# EAGLE design Filter Board rev1 (EAGLE 9.6.2)

## Sheet 1 of 4
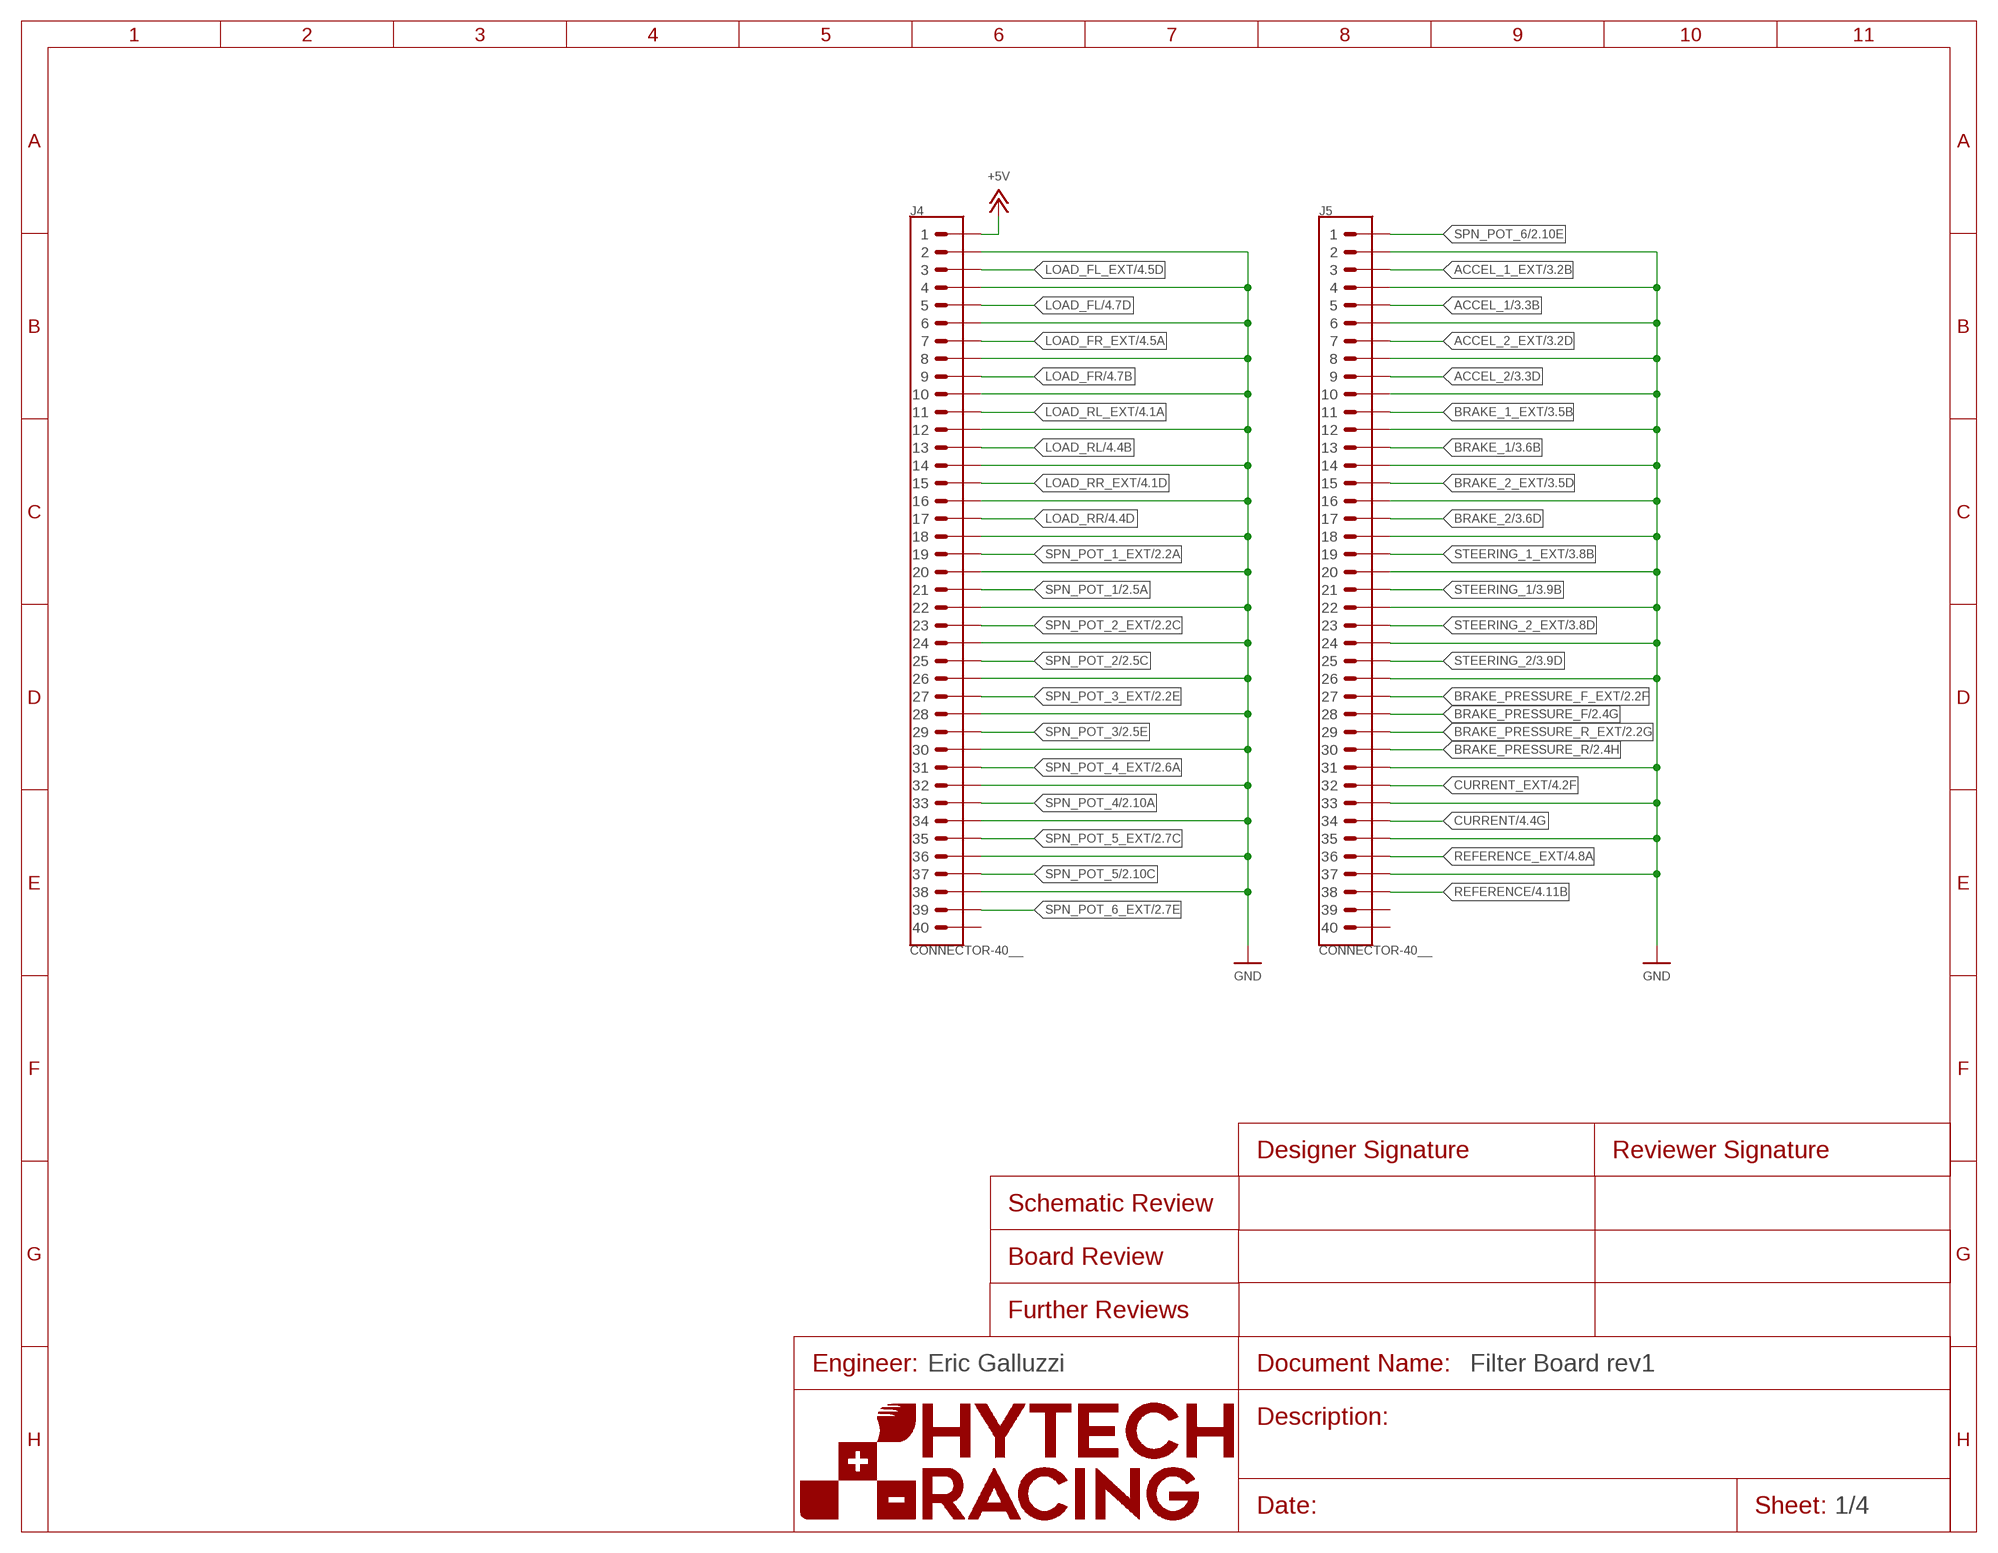
[diagram p0: schematic, sheet 1]
FRAME1 (FRAME): ENGINEER: Eric Galluzzi

### Parts
J4  CONNECTOR-40__  [EHT-120-01]
J5  CONNECTOR-40__  [EHT-120-01]

### Nets
+5V: J4.1 ; also sheet 3,4
ACCEL_1: J5.5 ; also sheet 3
ACCEL_1_EXT: J5.3 ; also sheet 3
ACCEL_2: J5.9 ; also sheet 3
ACCEL_2_EXT: J5.7 ; also sheet 3
BRAKE_1: J5.13 ; also sheet 3
BRAKE_1_EXT: J5.11 ; also sheet 3
BRAKE_2: J5.17 ; also sheet 3
BRAKE_2_EXT: J5.15 ; also sheet 3
BRAKE_PRESSURE_F: J5.28 ; also sheet 2
BRAKE_PRESSURE_F_EXT: J5.27 ; also sheet 2
BRAKE_PRESSURE_R: J5.30 ; also sheet 2
BRAKE_PRESSURE_R_EXT: J5.29 ; also sheet 2
CURRENT: J5.34 ; also sheet 4
CURRENT_EXT: J5.32 ; also sheet 4
GND: J4.2 J4.4 J4.6 J4.8 J4.10 J4.12 J4.14 J4.16 J4.18 J4.20 J4.22 J4.24 J4.26 J4.28 J4.30 J4.32 J4.34 J4.36 J4.38 J5.2 J5.4 J5.6 J5.8 J5.10 J5.12 J5.14 J5.16 J5.18 J5.20 J5.22 J5.24 J5.26 J5.31 J5.33 J5.35 J5.37 ; also sheet 2,3,4
LOAD_FL: J4.5 ; also sheet 4
LOAD_FL_EXT: J4.3 ; also sheet 4
LOAD_FR: J4.9 ; also sheet 4
LOAD_FR_EXT: J4.7 ; also sheet 4
LOAD_RL: J4.13 ; also sheet 4
LOAD_RL_EXT: J4.11 ; also sheet 4
LOAD_RR: J4.17 ; also sheet 4
LOAD_RR_EXT: J4.15 ; also sheet 4
REFERENCE: J5.38 ; also sheet 4
REFERENCE_EXT: J5.36 ; also sheet 4
SPN_POT_1: J4.21 ; also sheet 2
SPN_POT_1_EXT: J4.19 ; also sheet 2
SPN_POT_2: J4.25 ; also sheet 2
SPN_POT_2_EXT: J4.23 ; also sheet 2
SPN_POT_3: J4.29 ; also sheet 2
SPN_POT_3_EXT: J4.27 ; also sheet 2
SPN_POT_4: J4.33 ; also sheet 2
SPN_POT_4_EXT: J4.31 ; also sheet 2
SPN_POT_5: J4.37 ; also sheet 2
SPN_POT_5_EXT: J4.35 ; also sheet 2
SPN_POT_6: J5.1 ; also sheet 2
SPN_POT_6_EXT: J4.39 ; also sheet 2
STEERING_1: J5.21 ; also sheet 3
STEERING_1_EXT: J5.19 ; also sheet 3
STEERING_2: J5.25 ; also sheet 3
STEERING_2_EXT: J5.23 ; also sheet 3
Unconnected: J4.40 J5.39 J5.40

## Sheet 2 of 4
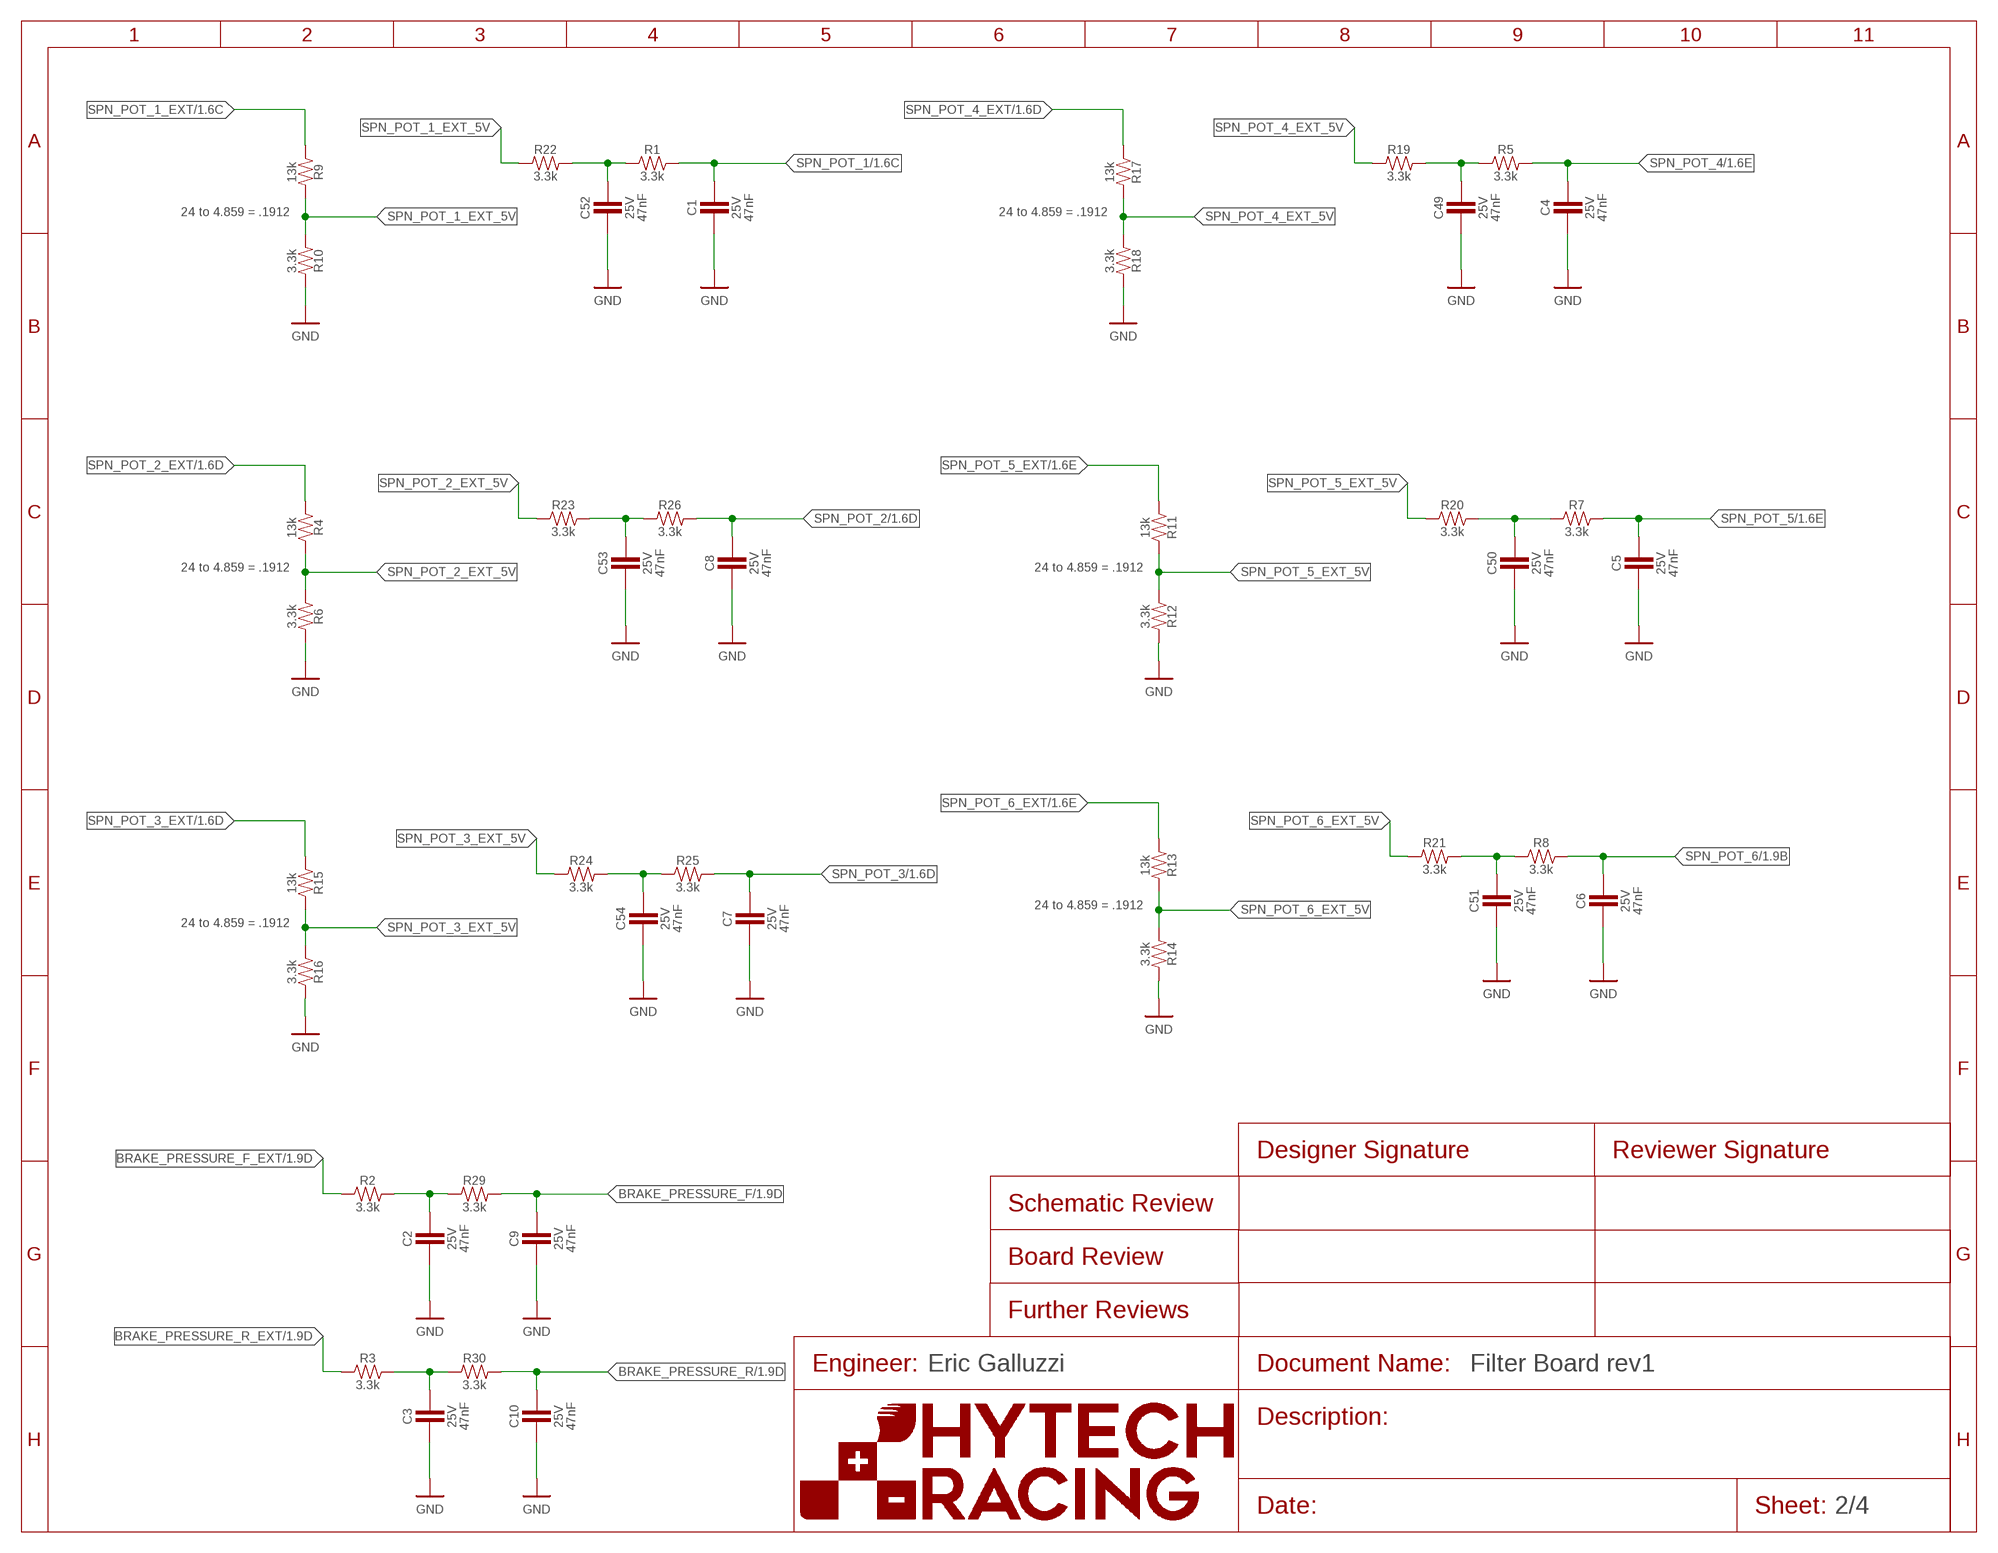
[diagram p1: schematic, sheet 2]
FRAME2 (FRAME): ENGINEER: Eric Galluzzi

### Parts
C1  CAPACITOR_0603_25V_47NF  [0603-CAP]
C2  CAPACITOR_0603_25V_47NF  [0603-CAP]
C3  CAPACITOR_0603_25V_47NF  [0603-CAP]
C4  CAPACITOR_0603_25V_47NF  [0603-CAP]
C5  CAPACITOR_0603_25V_47NF  [0603-CAP]
C6  CAPACITOR_0603_25V_47NF  [0603-CAP]
C7  CAPACITOR_0603_25V_47NF  [0603-CAP]
C8  CAPACITOR_0603_25V_47NF  [0603-CAP]
C9  CAPACITOR_0603_25V_47NF  [0603-CAP]
C10  CAPACITOR_0603_25V_47NF  [0603-CAP]
C49  CAPACITOR_0603_25V_47NF  [0603-CAP]
C50  CAPACITOR_0603_25V_47NF  [0603-CAP]
C51  CAPACITOR_0603_25V_47NF  [0603-CAP]
C52  CAPACITOR_0603_25V_47NF  [0603-CAP]
C53  CAPACITOR_0603_25V_47NF  [0603-CAP]
C54  CAPACITOR_0603_25V_47NF  [0603-CAP]
R1  RESISTOR_0603_3.3K  [0603-RES]
R2  RESISTOR_0603_3.3K  [0603-RES]
R3  RESISTOR_0603_3.3K  [0603-RES]
R4  RESISTOR_0603_13K  [0603-RES]
R5  RESISTOR_0603_3.3K  [0603-RES]
R6  RESISTOR_0603_3.3K  [0603-RES]
R7  RESISTOR_0603_3.3K  [0603-RES]
R8  RESISTOR_0603_3.3K  [0603-RES]
R9  RESISTOR_0603_13K  [0603-RES]
R10  RESISTOR_0603_3.3K  [0603-RES]
R11  RESISTOR_0603_13K  [0603-RES]
R12  RESISTOR_0603_3.3K  [0603-RES]
R13  RESISTOR_0603_13K  [0603-RES]
R14  RESISTOR_0603_3.3K  [0603-RES]
R15  RESISTOR_0603_13K  [0603-RES]
R16  RESISTOR_0603_3.3K  [0603-RES]
R17  RESISTOR_0603_13K  [0603-RES]
R18  RESISTOR_0603_3.3K  [0603-RES]
R19  RESISTOR_0603_3.3K  [0603-RES]
R20  RESISTOR_0603_3.3K  [0603-RES]
R21  RESISTOR_0603_3.3K  [0603-RES]
R22  RESISTOR_0603_3.3K  [0603-RES]
R23  RESISTOR_0603_3.3K  [0603-RES]
R24  RESISTOR_0603_3.3K  [0603-RES]
R25  RESISTOR_0603_3.3K  [0603-RES]
R26  RESISTOR_0603_3.3K  [0603-RES]
R29  RESISTOR_0603_3.3K  [0603-RES]
R30  RESISTOR_0603_3.3K  [0603-RES]

### Nets
BRAKE_PRESSURE_F: C9.1 R29.2 ; also sheet 1
BRAKE_PRESSURE_F_EXT: R2.1 ; also sheet 1
BRAKE_PRESSURE_R: C10.1 R30.2 ; also sheet 1
BRAKE_PRESSURE_R_EXT: R3.1 ; also sheet 1
GND: C1.2 C2.2 C3.2 C4.2 C5.2 C6.2 C7.2 C8.2 C9.2 C10.2 C49.2 C50.2 C51.2 C52.2 C53.2 C54.2 R6.2 R10.2 R12.2 R14.2 R16.2 R18.2 ; also sheet 1,3,4
N$4: C52.1 R1.1 R22.2
N$5: C49.1 R5.1 R19.2
N$6: C50.1 R7.1 R20.2
N$7: C51.1 R8.1 R21.2
N$8: C54.1 R24.2 R25.1
N$9: C53.1 R23.2 R26.1
N$10: C2.1 R2.2 R29.1
N$11: C3.1 R3.2 R30.1
SPN_POT_1: C1.1 R1.2 ; also sheet 1
SPN_POT_1_EXT: R9.1 ; also sheet 1
SPN_POT_1_EXT_5V: R9.2 R10.1 R22.1
SPN_POT_2: C8.1 R26.2 ; also sheet 1
SPN_POT_2_EXT: R4.1 ; also sheet 1
SPN_POT_2_EXT_5V: R4.2 R6.1 R23.1
SPN_POT_3: C7.1 R25.2 ; also sheet 1
SPN_POT_3_EXT: R15.1 ; also sheet 1
SPN_POT_3_EXT_5V: R15.2 R16.1 R24.1
SPN_POT_4: C4.1 R5.2 ; also sheet 1
SPN_POT_4_EXT: R17.1 ; also sheet 1
SPN_POT_4_EXT_5V: R17.2 R18.1 R19.1
SPN_POT_5: C5.1 R7.2 ; also sheet 1
SPN_POT_5_EXT: R11.1 ; also sheet 1
SPN_POT_5_EXT_5V: R11.2 R12.1 R20.1
SPN_POT_6: C6.1 R8.2 ; also sheet 1
SPN_POT_6_EXT: R13.1 ; also sheet 1
SPN_POT_6_EXT_5V: R13.2 R14.1 R21.1

### Notes on the sheet
- 24 to 4.859 = .1912 | 24 to 4.859 = .1912
- 24 to 4.859 = .1912 | 24 to 4.859 = .1912
- 24 to 4.859 = .1912
- 24 to 4.859 = .1912

## Sheet 3 of 4
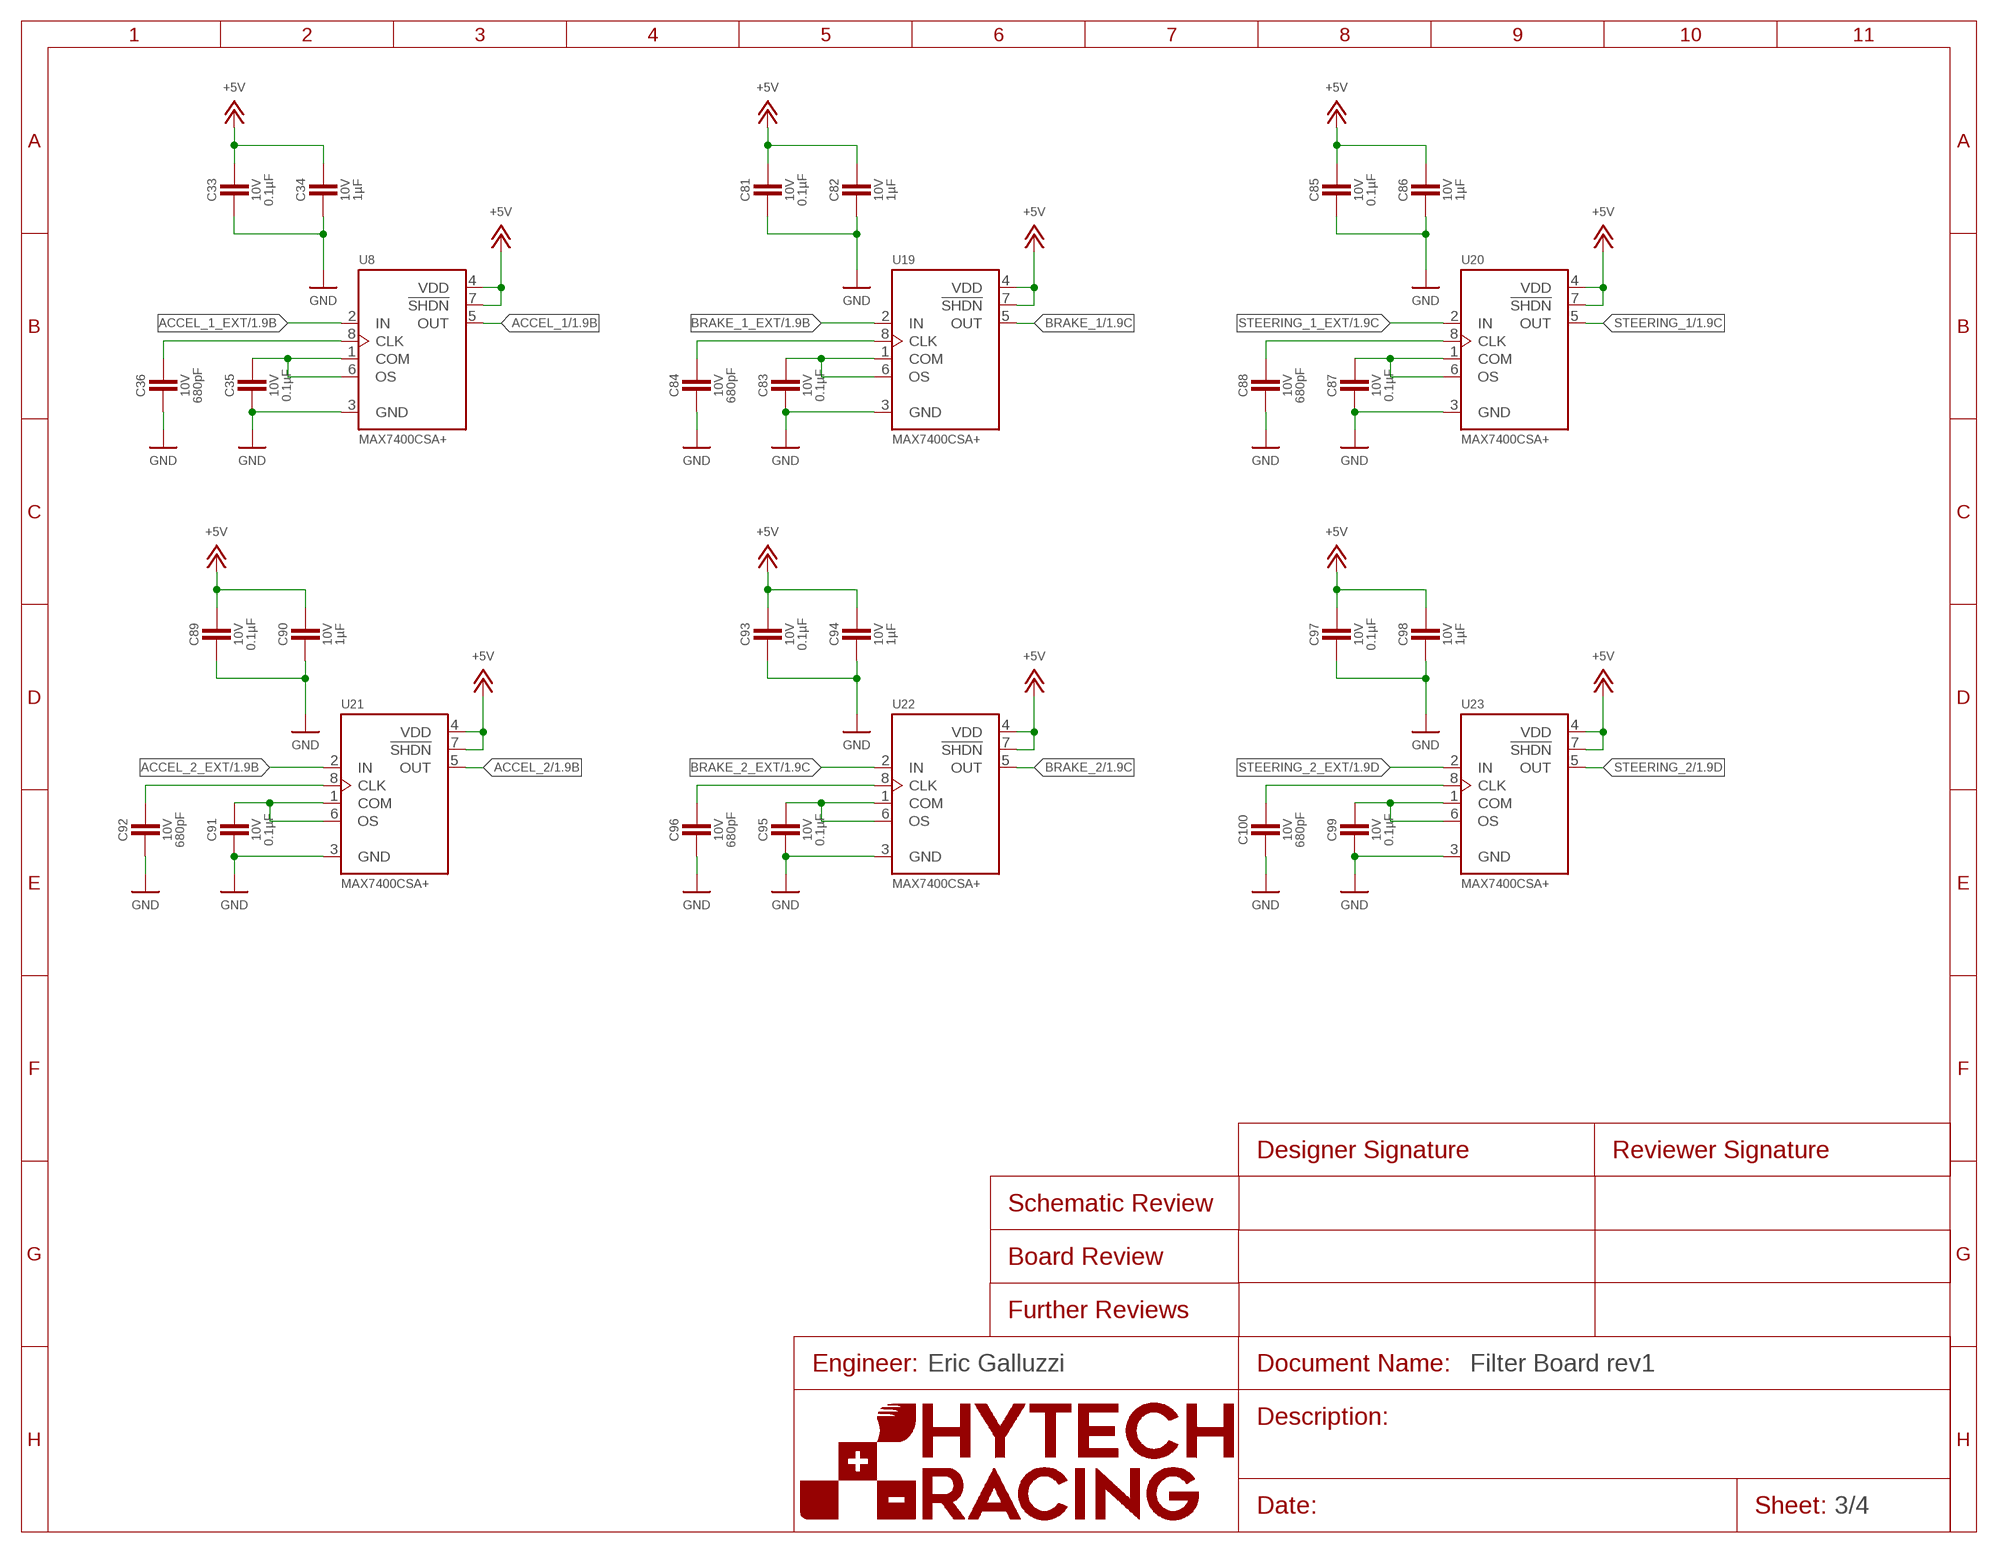
[diagram p2: schematic, sheet 3]
FRAME3 (FRAME): ENGINEER: Eric Galluzzi

### Parts
C33  CAPACITOR_0603_10V_0.1UF  [0603-CAP]
C34  CAPACITOR_0603_10V_1UF  [0603-CAP]
C35  CAPACITOR_0603_10V_0.1UF  [0603-CAP]
C36  CAPACITOR_0603_10V_680PF  [0603-CAP]
C81  CAPACITOR_0603_10V_0.1UF  [0603-CAP]
C82  CAPACITOR_0603_10V_1UF  [0603-CAP]
C83  CAPACITOR_0603_10V_0.1UF  [0603-CAP]
C84  CAPACITOR_0603_10V_680PF  [0603-CAP]
C85  CAPACITOR_0603_10V_0.1UF  [0603-CAP]
C86  CAPACITOR_0603_10V_1UF  [0603-CAP]
C87  CAPACITOR_0603_10V_0.1UF  [0603-CAP]
C88  CAPACITOR_0603_10V_680PF  [0603-CAP]
C89  CAPACITOR_0603_10V_0.1UF  [0603-CAP]
C90  CAPACITOR_0603_10V_1UF  [0603-CAP]
C91  CAPACITOR_0603_10V_0.1UF  [0603-CAP]
C92  CAPACITOR_0603_10V_680PF  [0603-CAP]
C93  CAPACITOR_0603_10V_0.1UF  [0603-CAP]
C94  CAPACITOR_0603_10V_1UF  [0603-CAP]
C95  CAPACITOR_0603_10V_0.1UF  [0603-CAP]
C96  CAPACITOR_0603_10V_680PF  [0603-CAP]
C97  CAPACITOR_0603_10V_0.1UF  [0603-CAP]
C98  CAPACITOR_0603_10V_1UF  [0603-CAP]
C99  CAPACITOR_0603_10V_0.1UF  [0603-CAP]
C100  CAPACITOR_0603_10V_680PF  [0603-CAP]
U8  MAX7400  [SOIC-08(NARROW,0.15")]
U19  MAX7400  [SOIC-08(NARROW,0.15")]
U20  MAX7400  [SOIC-08(NARROW,0.15")]
U21  MAX7400  [SOIC-08(NARROW,0.15")]
U22  MAX7400  [SOIC-08(NARROW,0.15")]
U23  MAX7400  [SOIC-08(NARROW,0.15")]

### Nets
+5V: C33.1 C34.1 C81.1 C82.1 C85.1 C86.1 C89.1 C90.1 C93.1 C94.1 C97.1 C98.1 U8.4(VDD) U8.7(!SHDN) U19.4(VDD) U19.7(!SHDN) U20.4(VDD) U20.7(!SHDN) U21.4(VDD) U21.7(!SHDN) U22.4(VDD) U22.7(!SHDN) U23.4(VDD) U23.7(!SHDN) ; also sheet 1,4
ACCEL_1: U8.5(OUT) ; also sheet 1
ACCEL_1_EXT: U8.2(IN) ; also sheet 1
ACCEL_2: U21.5(OUT) ; also sheet 1
ACCEL_2_EXT: U21.2(IN) ; also sheet 1
BRAKE_1: U19.5(OUT) ; also sheet 1
BRAKE_1_EXT: U19.2(IN) ; also sheet 1
BRAKE_2: U22.5(OUT) ; also sheet 1
BRAKE_2_EXT: U22.2(IN) ; also sheet 1
GND: C33.2 C34.2 C35.2 C36.2 C81.2 C82.2 C83.2 C84.2 C85.2 C86.2 C87.2 C88.2 C89.2 C90.2 C91.2 C92.2 C93.2 C94.2 C95.2 C96.2 C97.2 C98.2 C99.2 C100.2 U8.3(GND) U19.3(GND) U20.3(GND) U21.3(GND) U22.3(GND) U23.3(GND) ; also sheet 1,2,4
N$15: C36.1 U8.8(CLK)
N$16: C35.1 U8.1(COM) U8.6(OS)
N$23: C84.1 U19.8(CLK)
N$24: C83.1 U19.1(COM) U19.6(OS)
N$39: C88.1 U20.8(CLK)
N$40: C87.1 U20.1(COM) U20.6(OS)
N$41: C92.1 U21.8(CLK)
N$42: C91.1 U21.1(COM) U21.6(OS)
N$43: C96.1 U22.8(CLK)
N$44: C95.1 U22.1(COM) U22.6(OS)
N$45: C100.1 U23.8(CLK)
N$46: C99.1 U23.1(COM) U23.6(OS)
STEERING_1: U20.5(OUT) ; also sheet 1
STEERING_1_EXT: U20.2(IN) ; also sheet 1
STEERING_2: U23.5(OUT) ; also sheet 1
STEERING_2_EXT: U23.2(IN) ; also sheet 1

## Sheet 4 of 4
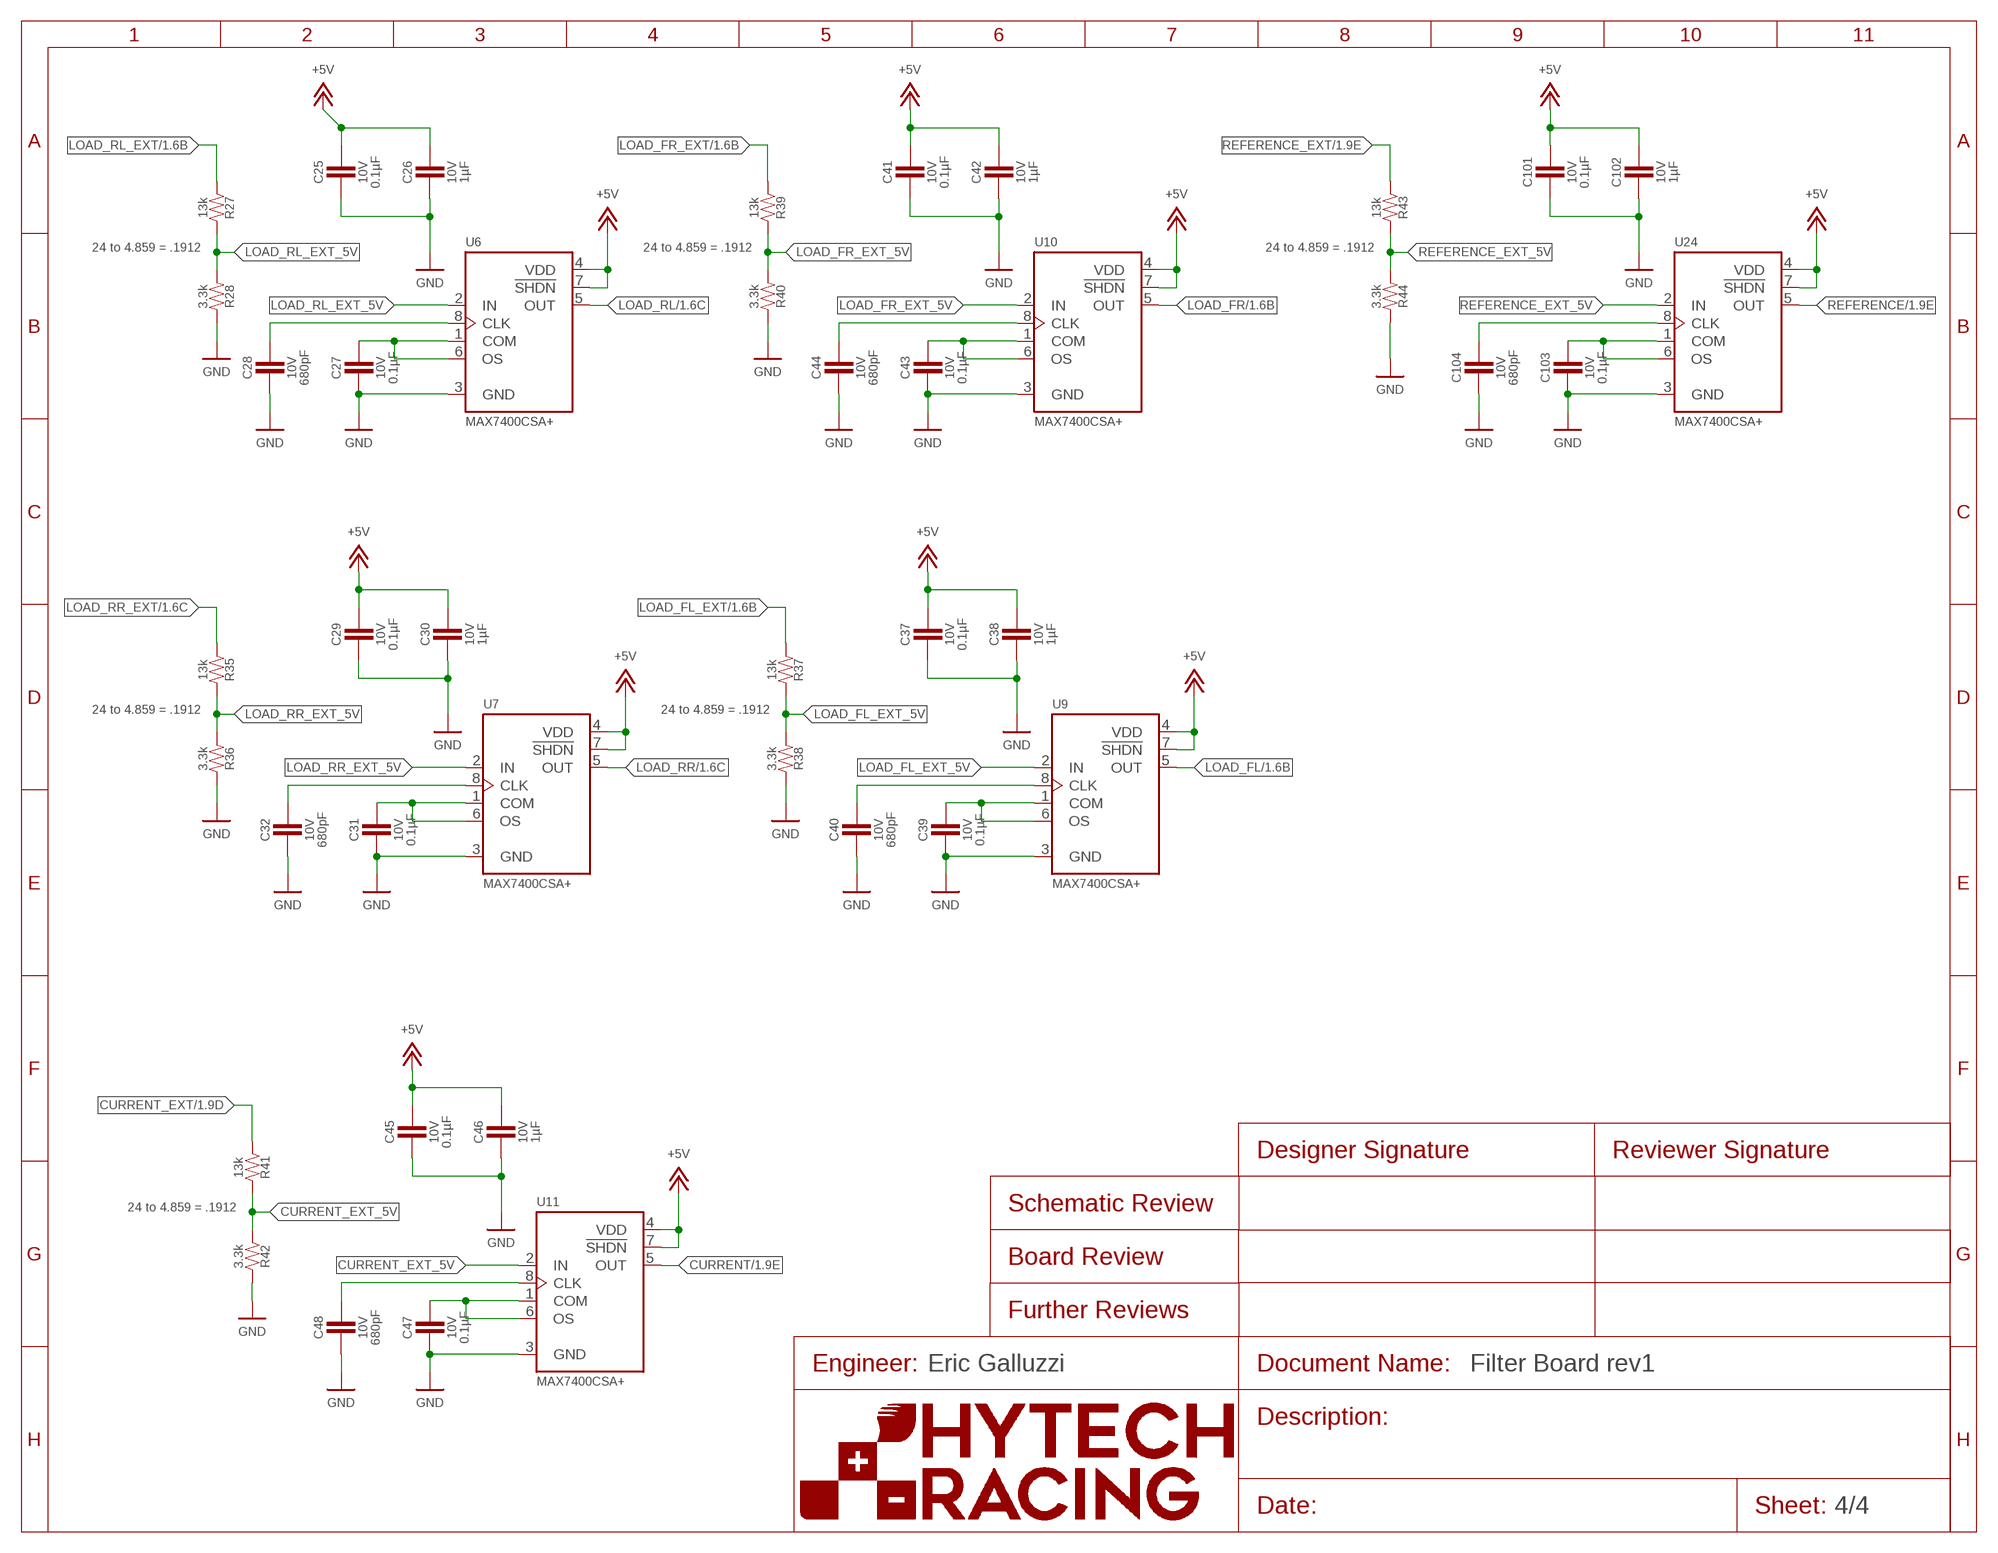
[diagram p3: schematic, sheet 4]
FRAME4 (FRAME): ENGINEER: Eric Galluzzi

### Parts
C25  CAPACITOR_0603_10V_0.1UF  [0603-CAP]
C26  CAPACITOR_0603_10V_1UF  [0603-CAP]
C27  CAPACITOR_0603_10V_0.1UF  [0603-CAP]
C28  CAPACITOR_0603_10V_680PF  [0603-CAP]
C29  CAPACITOR_0603_10V_0.1UF  [0603-CAP]
C30  CAPACITOR_0603_10V_1UF  [0603-CAP]
C31  CAPACITOR_0603_10V_0.1UF  [0603-CAP]
C32  CAPACITOR_0603_10V_680PF  [0603-CAP]
C37  CAPACITOR_0603_10V_0.1UF  [0603-CAP]
C38  CAPACITOR_0603_10V_1UF  [0603-CAP]
C39  CAPACITOR_0603_10V_0.1UF  [0603-CAP]
C40  CAPACITOR_0603_10V_680PF  [0603-CAP]
C41  CAPACITOR_0603_10V_0.1UF  [0603-CAP]
C42  CAPACITOR_0603_10V_1UF  [0603-CAP]
C43  CAPACITOR_0603_10V_0.1UF  [0603-CAP]
C44  CAPACITOR_0603_10V_680PF  [0603-CAP]
C45  CAPACITOR_0603_10V_0.1UF  [0603-CAP]
C46  CAPACITOR_0603_10V_1UF  [0603-CAP]
C47  CAPACITOR_0603_10V_0.1UF  [0603-CAP]
C48  CAPACITOR_0603_10V_680PF  [0603-CAP]
C101  CAPACITOR_0603_10V_0.1UF  [0603-CAP]
C102  CAPACITOR_0603_10V_1UF  [0603-CAP]
C103  CAPACITOR_0603_10V_0.1UF  [0603-CAP]
C104  CAPACITOR_0603_10V_680PF  [0603-CAP]
R27  RESISTOR_0603_13K  [0603-RES]
R28  RESISTOR_0603_3.3K  [0603-RES]
R35  RESISTOR_0603_13K  [0603-RES]
R36  RESISTOR_0603_3.3K  [0603-RES]
R37  RESISTOR_0603_13K  [0603-RES]
R38  RESISTOR_0603_3.3K  [0603-RES]
R39  RESISTOR_0603_13K  [0603-RES]
R40  RESISTOR_0603_3.3K  [0603-RES]
R41  RESISTOR_0603_13K  [0603-RES]
R42  RESISTOR_0603_3.3K  [0603-RES]
R43  RESISTOR_0603_13K  [0603-RES]
R44  RESISTOR_0603_3.3K  [0603-RES]
U6  MAX7400  [SOIC-08(NARROW,0.15")]
U7  MAX7400  [SOIC-08(NARROW,0.15")]
U9  MAX7400  [SOIC-08(NARROW,0.15")]
U10  MAX7400  [SOIC-08(NARROW,0.15")]
U11  MAX7400  [SOIC-08(NARROW,0.15")]
U24  MAX7400  [SOIC-08(NARROW,0.15")]

### Nets
+5V: C25.1 C26.1 C29.1 C30.1 C37.1 C38.1 C41.1 C42.1 C45.1 C46.1 C101.1 C102.1 U6.4(VDD) U6.7(!SHDN) U7.4(VDD) U7.7(!SHDN) U9.4(VDD) U9.7(!SHDN) U10.4(VDD) U10.7(!SHDN) U11.4(VDD) U11.7(!SHDN) U24.4(VDD) U24.7(!SHDN) ; also sheet 1,3
CURRENT: U11.5(OUT) ; also sheet 1
CURRENT_EXT: R41.1 ; also sheet 1
CURRENT_EXT_5V: R41.2 R42.1 U11.2(IN)
GND: C25.2 C26.2 C27.2 C28.2 C29.2 C30.2 C31.2 C32.2 C37.2 C38.2 C39.2 C40.2 C41.2 C42.2 C43.2 C44.2 C45.2 C46.2 C47.2 C48.2 C101.2 C102.2 C103.2 C104.2 R28.2 R36.2 R38.2 R40.2 R42.2 R44.2 U6.3(GND) U7.3(GND) U9.3(GND) U10.3(GND) U11.3(GND) U24.3(GND) ; also sheet 1,2,3
LOAD_FL: U9.5(OUT) ; also sheet 1
LOAD_FL_EXT: R37.1 ; also sheet 1
LOAD_FL_EXT_5V: R37.2 R38.1 U9.2(IN)
LOAD_FR: U10.5(OUT) ; also sheet 1
LOAD_FR_EXT: R39.1 ; also sheet 1
LOAD_FR_EXT_5V: R39.2 R40.1 U10.2(IN)
LOAD_RL: U6.5(OUT) ; also sheet 1
LOAD_RL_EXT: R27.1 ; also sheet 1
LOAD_RL_EXT_5V: R27.2 R28.1 U6.2(IN)
LOAD_RR: U7.5(OUT) ; also sheet 1
LOAD_RR_EXT: R35.1 ; also sheet 1
LOAD_RR_EXT_5V: R35.2 R36.1 U7.2(IN)
N$1: C28.1 U6.8(CLK)
N$2: C27.1 U6.1(COM) U6.6(OS)
N$13: C32.1 U7.8(CLK)
N$14: C31.1 U7.1(COM) U7.6(OS)
N$17: C40.1 U9.8(CLK)
N$18: C39.1 U9.1(COM) U9.6(OS)
N$19: C44.1 U10.8(CLK)
N$20: C43.1 U10.1(COM) U10.6(OS)
N$21: C48.1 U11.8(CLK)
N$22: C47.1 U11.1(COM) U11.6(OS)
N$47: C104.1 U24.8(CLK)
N$48: C103.1 U24.1(COM) U24.6(OS)
REFERENCE: U24.5(OUT) ; also sheet 1
REFERENCE_EXT: R43.1 ; also sheet 1
REFERENCE_EXT_5V: R43.2 R44.1 U24.2(IN)

### Notes on the sheet
- 24 to 4.859 = .1912 | 24 to 4.859 = .1912 | 24 to 4.859 = .1912
- 24 to 4.859 = .1912 | 24 to 4.859 = .1912
- 24 to 4.859 = .1912

## Library data of the parts
C1-C10 C49-C54 = HyTechDevices:CAPACITOR_?_*: Capacitor, Non-Polarized VJ...1BC Series Datasheet <https://www.mouser.com/datasheet/2/427/vjw1bcbascomseries-1762447.pdf> Samsung Datasheet <https://www.mouser.com/datasheet/2/585/MLCC-1837944.pdf> Walsin Datasheet <https://www.mouser.com/datasheet/2/210/WTC_MLCC_General_Purpose-1534899.pdf> GRM188R61A226ME15D <https://www.mouser.com/datasheet/2/281/1/GRM188R61A226ME15_02A-1985787.pdf> GRM188R61E106MA73D <https://www.mouser.com/datasheet/2/281/1/GRM188R61E106MA73_01A-1985806.pdf> 885012006013 <https://www.mouser.com/datasheet/2/445/885012006013-1726946.pdf> 2220Y6300105KXTWS2 <https://www.mouser.com/datasheet/2/218/SMD_High_and_Std_StackiCap_P62-1825512.pdf> Yageo Class 2, X5R <https://www.mouser.com/datasheet/2/447/UPY_GPHC_X5R_4V_to_50V_26-1827097.pdf> TDK C Series <https://www.mouser.com/ProductDetail/TDK/C3216X5R1V226M160AC?qs=%2Fha2pyFadujbcx9jh7lYl%2F4NeMoXFhdc8AqVWNq4wW6M2y7zl6GzBuhgtI0ngznN> AVX Automotive MLCC <https://www.mouser.com/datasheet/2/40/AutoMLCC-777028.pdf> KEMET X7R Series <https://www.mouser.com/datasheet/2/212/KEM_C1002_X7R_SMD-1102033.pdf> Kyocera AVX <https://www.mouser.com/datasheet/2/40/C0GNP0_Dielectric-951274.pdf> GRM21BR61H <https://www.mouser.com/datasheet/2/281/1/GRM21BR61H106KE43_01A-1986884.pdf>; CAPACITANCE: 47nF; DKPN: 478-6340-1-ND; MANUFACTURER: Kyocera AVX; MOPN: 581-06033C473K42ZA; MPN: 06033C473K4Z2A; TOLERANCE: 10%; VOLTAGE: 25V
C25 C27 C29 C31 C33 C35 C37 C39 C41 C43 C45 C47 C81 C83 C85 C87 C89 C91 C93 C95 C97 C99 C101 C103 = HyTechDevices:CAPACITOR_?_*: Capacitor, Non-Polarized VJ...1BC Series Datasheet <https://www.mouser.com/datasheet/2/427/vjw1bcbascomseries-1762447.pdf> Samsung Datasheet <https://www.mouser.com/datasheet/2/585/MLCC-1837944.pdf> Walsin Datasheet <https://www.mouser.com/datasheet/2/210/WTC_MLCC_General_Purpose-1534899.pdf> GRM188R61A226ME15D <https://www.mouser.com/datasheet/2/281/1/GRM188R61A226ME15_02A-1985787.pdf> GRM188R61E106MA73D <https://www.mouser.com/datasheet/2/281/1/GRM188R61E106MA73_01A-1985806.pdf> 885012006013 <https://www.mouser.com/datasheet/2/445/885012006013-1726946.pdf> 2220Y6300105KXTWS2 <https://www.mouser.com/datasheet/2/218/SMD_High_and_Std_StackiCap_P62-1825512.pdf> Yageo Class 2, X5R <https://www.mouser.com/datasheet/2/447/UPY_GPHC_X5R_4V_to_50V_26-1827097.pdf> TDK C Series <https://www.mouser.com/ProductDetail/TDK/C3216X5R1V226M160AC?qs=%2Fha2pyFadujbcx9jh7lYl%2F4NeMoXFhdc8AqVWNq4wW6M2y7zl6GzBuhgtI0ngznN> AVX Automotive MLCC <https://www.mouser.com/datasheet/2/40/AutoMLCC-777028.pdf> KEMET X7R Series <https://www.mouser.com/datasheet/2/212/KEM_C1002_X7R_SMD-1102033.pdf> Kyocera AVX <https://www.mouser.com/datasheet/2/40/C0GNP0_Dielectric-951274.pdf> GRM21BR61H <https://www.mouser.com/datasheet/2/281/1/GRM21BR61H106KE43_01A-1986884.pdf>; CAPACITANCE: 0.1µF; DKPN: 720-1688-1-ND; MANUFACTURER: Vishay Vitramon; MOPN: 77-VJ0603Y104JXQPBC; MPN: VJ0603Y104JXQPW1BC; TOLERANCE: 5%; VOLTAGE: 10V
C26 C30 C34 C38 C42 C46 C82 C86 C90 C94 C98 C102 = HyTechDevices:CAPACITOR_?_*: Capacitor, Non-Polarized VJ...1BC Series Datasheet <https://www.mouser.com/datasheet/2/427/vjw1bcbascomseries-1762447.pdf> Samsung Datasheet <https://www.mouser.com/datasheet/2/585/MLCC-1837944.pdf> Walsin Datasheet <https://www.mouser.com/datasheet/2/210/WTC_MLCC_General_Purpose-1534899.pdf> GRM188R61A226ME15D <https://www.mouser.com/datasheet/2/281/1/GRM188R61A226ME15_02A-1985787.pdf> GRM188R61E106MA73D <https://www.mouser.com/datasheet/2/281/1/GRM188R61E106MA73_01A-1985806.pdf> 885012006013 <https://www.mouser.com/datasheet/2/445/885012006013-1726946.pdf> 2220Y6300105KXTWS2 <https://www.mouser.com/datasheet/2/218/SMD_High_and_Std_StackiCap_P62-1825512.pdf> Yageo Class 2, X5R <https://www.mouser.com/datasheet/2/447/UPY_GPHC_X5R_4V_to_50V_26-1827097.pdf> TDK C Series <https://www.mouser.com/ProductDetail/TDK/C3216X5R1V226M160AC?qs=%2Fha2pyFadujbcx9jh7lYl%2F4NeMoXFhdc8AqVWNq4wW6M2y7zl6GzBuhgtI0ngznN> AVX Automotive MLCC <https://www.mouser.com/datasheet/2/40/AutoMLCC-777028.pdf> KEMET X7R Series <https://www.mouser.com/datasheet/2/212/KEM_C1002_X7R_SMD-1102033.pdf> Kyocera AVX <https://www.mouser.com/datasheet/2/40/C0GNP0_Dielectric-951274.pdf> GRM21BR61H <https://www.mouser.com/datasheet/2/281/1/GRM21BR61H106KE43_01A-1986884.pdf>; CAPACITANCE: 1µF; DKPN: 311-1796-1-ND; MANUFACTURER: Yageo; MOPN: 603-CC603KRX7R6BB105; MPN: CC0603KRX7R6BB105; TOLERANCE: 10%; VOLTAGE: 10V
C28 C32 C36 C40 C44 C48 C84 C88 C92 C96 C100 C104 = HyTechDevices:CAPACITOR_?_*: Capacitor, Non-Polarized VJ...1BC Series Datasheet <https://www.mouser.com/datasheet/2/427/vjw1bcbascomseries-1762447.pdf> Samsung Datasheet <https://www.mouser.com/datasheet/2/585/MLCC-1837944.pdf> Walsin Datasheet <https://www.mouser.com/datasheet/2/210/WTC_MLCC_General_Purpose-1534899.pdf> GRM188R61A226ME15D <https://www.mouser.com/datasheet/2/281/1/GRM188R61A226ME15_02A-1985787.pdf> GRM188R61E106MA73D <https://www.mouser.com/datasheet/2/281/1/GRM188R61E106MA73_01A-1985806.pdf> 885012006013 <https://www.mouser.com/datasheet/2/445/885012006013-1726946.pdf> 2220Y6300105KXTWS2 <https://www.mouser.com/datasheet/2/218/SMD_High_and_Std_StackiCap_P62-1825512.pdf> Yageo Class 2, X5R <https://www.mouser.com/datasheet/2/447/UPY_GPHC_X5R_4V_to_50V_26-1827097.pdf> TDK C Series <https://www.mouser.com/ProductDetail/TDK/C3216X5R1V226M160AC?qs=%2Fha2pyFadujbcx9jh7lYl%2F4NeMoXFhdc8AqVWNq4wW6M2y7zl6GzBuhgtI0ngznN> AVX Automotive MLCC <https://www.mouser.com/datasheet/2/40/AutoMLCC-777028.pdf> KEMET X7R Series <https://www.mouser.com/datasheet/2/212/KEM_C1002_X7R_SMD-1102033.pdf> Kyocera AVX <https://www.mouser.com/datasheet/2/40/C0GNP0_Dielectric-951274.pdf> GRM21BR61H <https://www.mouser.com/datasheet/2/281/1/GRM21BR61H106KE43_01A-1986884.pdf>; CAPACITANCE: 680pF; DKPN: 732-7757-1-ND; MANUFACTURER: Würth Elektronik; MOPN: 710-885012006013; MPN: 885012006013; TOLERANCE: 5%; VOLTAGE: 10V
J4 J5 = HyTechDevices:CONNECTOR-40_?_*: 40 pin ribbon connector header (EHT-120-01) Catalog <https://suddendocs.samtec.com/catalog_english/eht.pdf> Datasheet <http://suddendocs.samtec.com/prints/eht-d.pdf> Part <https://www.digikey.com/en/products/detail/samtec-inc/EHT-120-01-S-D/1106698>; DKPN: SAM8560-ND; MANUFACTURER: Samtec; MOPN: 200-EHT12001SD; MPN: EHT-120-01-S-D
R1-R3 R5-R8 R10 R12 R14 R16 R18-R26 R28-R30 R36 R38 R40 R42 R44 = HyTechDevices:RESISTOR_?_*: Resistor PWR163 Series <https://www.mouser.com/datasheet/2/54/pwr163-777985.pdf> AC Series <https://www.mouser.com/datasheet/2/447/Yageo_PYu_AC_51_RoHS_L_7_1714230-1874691.pdf> PU Series <https://www.mouser.com/datasheet/2/447/PYu-PU_51_RoHS_L_6-1504619.pdf> ERA Series <https://www.mouser.com/datasheet/2/315/AOA0000C307-1149632.pdf> PWR263 Series <https://www.mouser.com/datasheet/2/54/pwr263s_35-778069.pdf> KTR Series <https://www.mouser.com/datasheet/2/348/ROHM_S_A0011075115_1-2563276.pdf> RC Series <https://www.mouser.com/datasheet/2/447/Yageo_03_18_2021_PYu_RC_Group_51_RoHS_L_11-2199992.pdf> ERJ PB3, PB6 Series <https://www.mouser.com/datasheet/2/315/AOA0000C328-1530132.pdf> ERJ PA2, P03, PA3, P06, P08, P14 Series <https://www.mouser.com/datasheet/2/315/AOA0000C331-1141874.pdf> B20 Series <https://www.ohmite.com/assets/docs/res_200.pdf?r=false> TE Connectivity/Holsworthy RN73 Series <https://www.mouser.com/datasheet/2/418/4/NG_DS_1773270_M-604713.pdf> Vishay Dale D/CRCW e3 <https://www.mouser.com/datasheet/2/427/dcrcwe3-1762152.pdf> Ohmite B20 <https://www.ohmite.com/assets/docs/res_200.pdf?r=false>; DKPN: P20340TR-ND; MANUFACTURER: Panasonic Electronic Components; MOPN: 667-ERJ-PB3D3301V; MPN: ERJ-PB3D3301V; POWER: 0.2W; RESISTANCE: 3.3k; TOLERANCE: 0.5%; VOLTAGE_CONTINUOUS: 25.69V; VOLTAGE_MAX: 150
R4 R9 R11 R13 R15 R17 R27 R35 R37 R39 R41 R43 = HyTechDevices:RESISTOR_?_*: Resistor PWR163 Series <https://www.mouser.com/datasheet/2/54/pwr163-777985.pdf> AC Series <https://www.mouser.com/datasheet/2/447/Yageo_PYu_AC_51_RoHS_L_7_1714230-1874691.pdf> PU Series <https://www.mouser.com/datasheet/2/447/PYu-PU_51_RoHS_L_6-1504619.pdf> ERA Series <https://www.mouser.com/datasheet/2/315/AOA0000C307-1149632.pdf> PWR263 Series <https://www.mouser.com/datasheet/2/54/pwr263s_35-778069.pdf> KTR Series <https://www.mouser.com/datasheet/2/348/ROHM_S_A0011075115_1-2563276.pdf> RC Series <https://www.mouser.com/datasheet/2/447/Yageo_03_18_2021_PYu_RC_Group_51_RoHS_L_11-2199992.pdf> ERJ PB3, PB6 Series <https://www.mouser.com/datasheet/2/315/AOA0000C328-1530132.pdf> ERJ PA2, P03, PA3, P06, P08, P14 Series <https://www.mouser.com/datasheet/2/315/AOA0000C331-1141874.pdf> B20 Series <https://www.ohmite.com/assets/docs/res_200.pdf?r=false> TE Connectivity/Holsworthy RN73 Series <https://www.mouser.com/datasheet/2/418/4/NG_DS_1773270_M-604713.pdf> Vishay Dale D/CRCW e3 <https://www.mouser.com/datasheet/2/427/dcrcwe3-1762152.pdf> Ohmite B20 <https://www.ohmite.com/assets/docs/res_200.pdf?r=false>; DKPN: P13KBECT-ND; MANUFACTURER: Panasonic Electronic Components; MOPN: 667-ERA-3ARW133V; MPN: ERA-3ARW133V; POWER: 0.1W; RESISTANCE: 13k; TOLERANCE: 0.05%; VOLTAGE_CONTINUOUS: 75V; VOLTAGE_MAX: 150V
U6-U11 U19-U24 = HyTechDevices:MAX74*: 8th-Order Maxim Filter MAX7480 Datasheet <https://www.mouser.com/datasheet/2/256/MAX7480-1515905.pdf> MAX7400 Datsheet <https://www.mouser.com/datasheet/2/256/MAX7404-1514314.pdf> Recommended clock capacitor for the MAX7400/MAX7404: 885012006013 <https://www.mouser.com/datasheet/2/445/885012006013-1726946.pdf>; DKPN: MAX7400CSA+-ND; MANUFACTURER: Maxim Integrated; MOPN: 700-MAX7400CSA; MPN: MAX7400CSA+

## Board
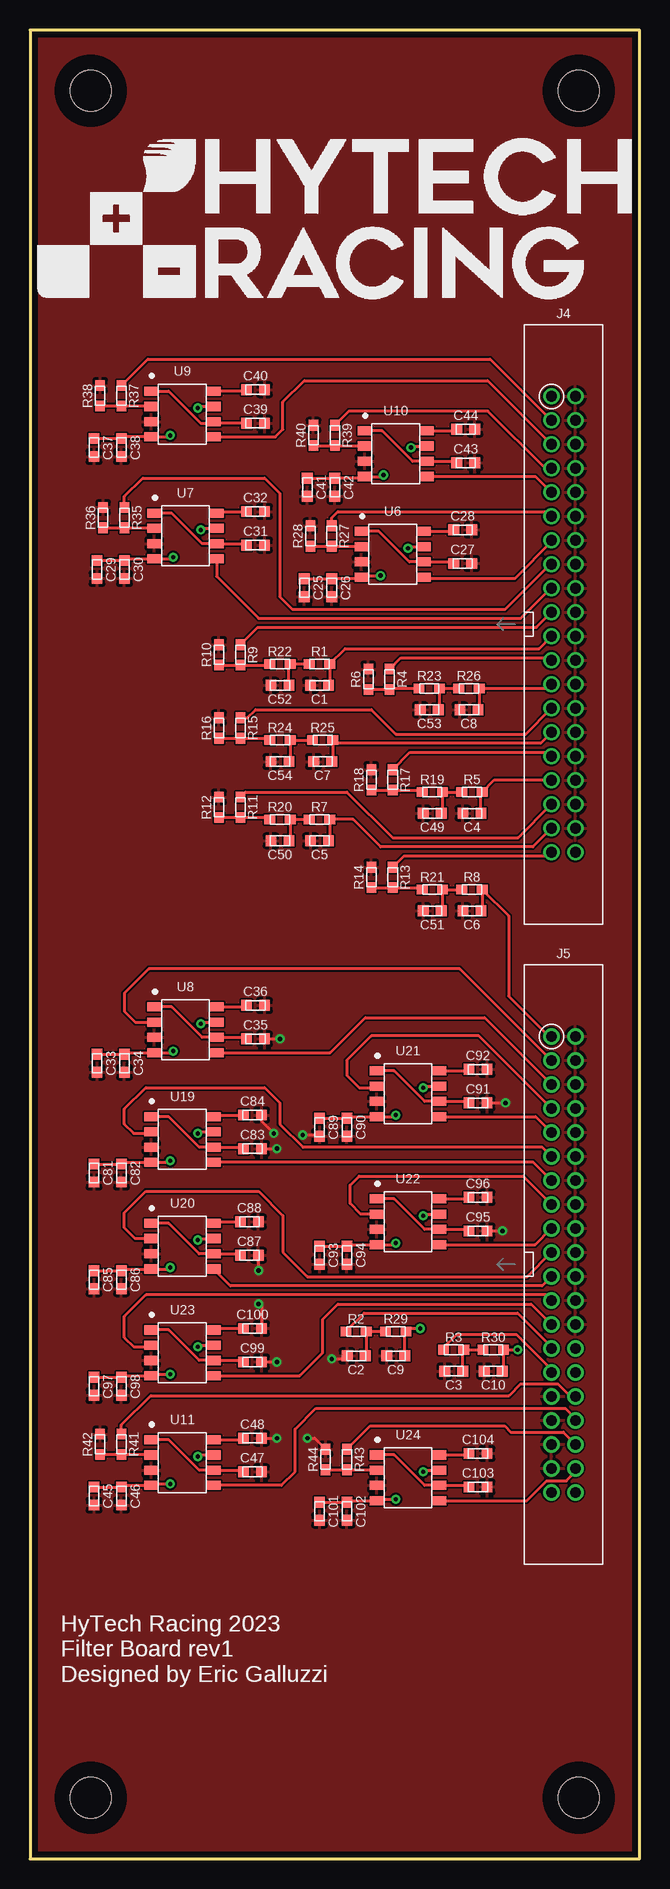
[diagram p4: board, top side]
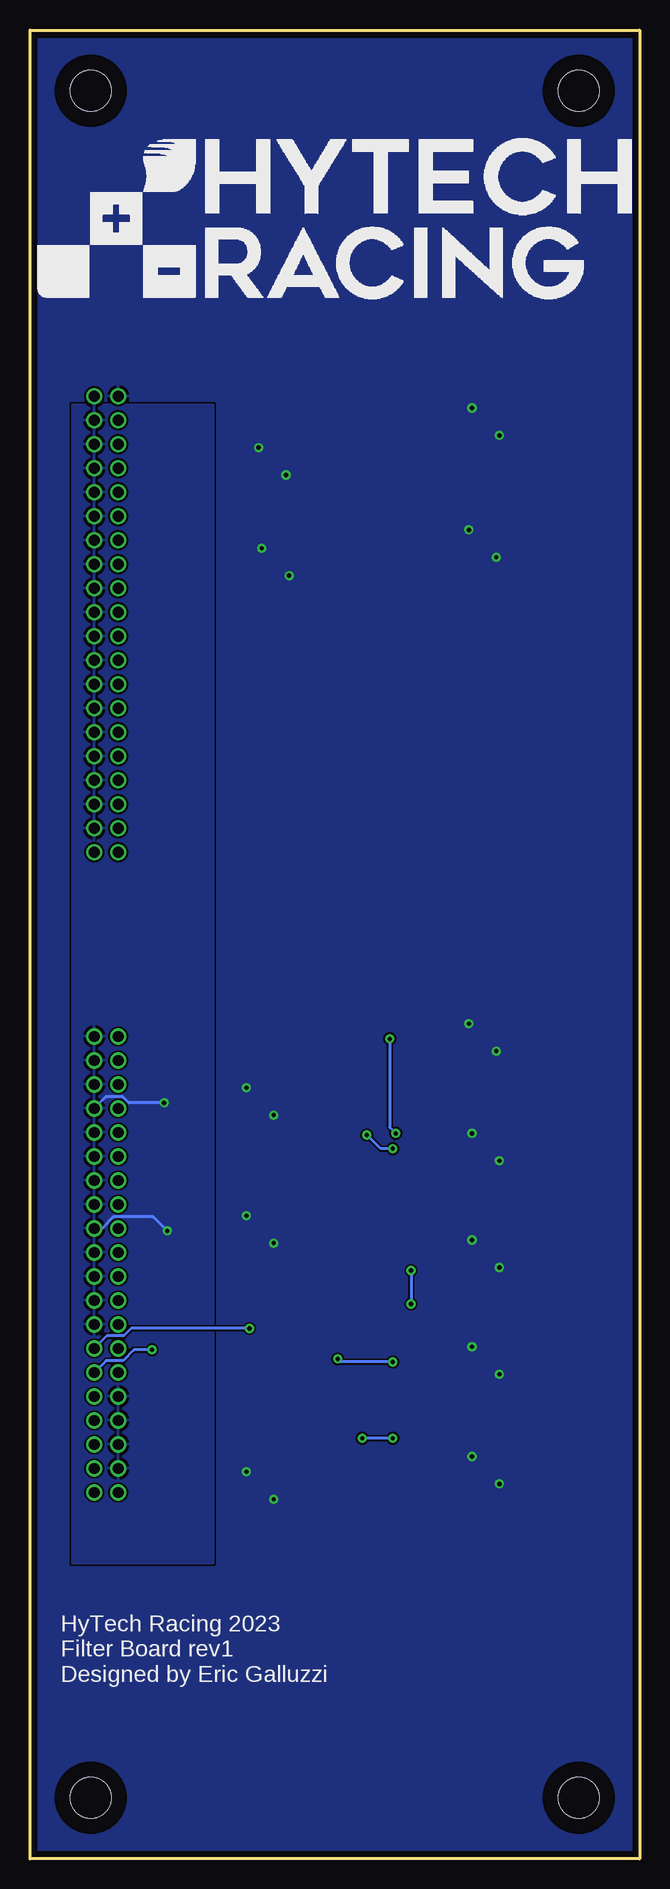
[diagram p5: board, bottom side, seen from below]

Size 50.8 x 152.4 mm. Coordinates in mm from the lower left corner, seen from the top.
Outline: 0,0 50.8,0 50.8,152.4 0,152.4 0,0
Copper layers (1*16): Top 0.035mm / dielectric 1.53mm / Bottom 0.035mm
Design rules "HyTech Default (2 Layer)": minimum track width 6mil, minimum drill 14mil, track to track 6mil, track to pad 6mil, pad to pad 6mil, via to via 20mil, smd to smd 6mil, copper to edge 20mil, drill to drill 21mil, minimum pad ring 7mil, minimum via ring 8mil, stop-mask expansion 6mil, vias tented up to drill 30mil, thermal gap 10mil

### Footprints (pad centres in the part's own frame; a part is rotated, then mirrored left to right if it is on the bottom)
0603-CAP = smd 0.9 x 0.9: 1 -0.75,0; 2 0.75,0
EHT-120-01 = drill 0.9: 1 -19,-1; 2 -19,1; 3 -17,-1; 4 -17,1; 5 -15,-1; 6 -15,1; 7 -13,-1; 8 -13,1; 9 -11,-1; 10 -11,1; 11 -9,-1; 12 -9,1; 13 -7,-1; 14 -7,1; 15 -5,-1; 16 -5,1; 17 -3,-1; 18 -3,1; 19 -1,-1; 20 -1,1; 21 1,-1; 22 1,1; 23 3,-1; 24 3,1; 25 5,-1; 26 5,1; 27 7,-1; 28 7,1; 29 9,-1; 30 9,1; 31 11,-1; 32 11,1; 33 13,-1; 34 13,1; 35 15,-1; 36 15,1; 37 17,-1; 38 17,1; 39 19,-1; 40 19,1
0603-RES = smd 0.9 x 0.8: 1 -0.85,0; 2 0.85,0
SOIC-08(NARROW,0.15") = smd 0.762 x 1.143: 1 -1.905,-2.603; 2 -0.635,-2.603; 3 0.635,-2.603; 4 1.905,-2.603; 5 1.905,2.603; 6 0.635,2.603; 7 -0.635,2.603; 8 -1.905,2.603
MOUNTING_M3 = hole 3.4: 0,0

### Placement (x,y rotation side)
C1  24.13,97.79 180 top
C2  27.18,41.91 180 top
C3  35.31,40.64 180 top
C4  36.83,87.12 180 top
C5  24.13,84.84 180 top
C6  36.83,78.99 180 top
C7  24.38,91.44 180 top
C8  36.58,95.76 180 top
C9  30.48,41.91 180 top
C10  38.61,40.64 180 top
C25  22.86,105.92 270 top
C26  25.15,105.92 270 top
C27  36.07,107.95 0 top
C28  36.07,110.74 0 top
C29  5.59,107.44 270 top
C30  7.87,107.44 270 top
C31  18.8,109.47 0 top
C32  18.8,112.27 0 top
C33  5.59,66.29 270 top
C34  7.87,66.29 270 top
C35  18.8,68.33 0 top
C36  18.8,71.12 0 top
C37  5.33,117.6 270 top
C38  7.62,117.6 270 top
C39  18.8,119.63 0 top
C40  18.8,122.43 0 top
C41  23.11,114.3 270 top
C42  25.4,114.3 270 top
C43  36.32,116.33 0 top
C44  36.32,119.13 0 top
C45  5.33,30.23 270 top
C46  7.62,30.23 270 top
C47  18.54,32.26 0 top
C48  18.54,35.05 0 top
C49  33.53,87.12 180 top
C50  20.83,84.84 180 top
C51  33.53,78.99 180 top
C52  20.83,97.79 180 top
C53  33.27,95.76 180 top
C54  20.83,91.44 180 top
C81  5.33,57.15 270 top
C82  7.62,57.15 270 top
C83  18.54,59.18 0 top
C84  18.54,61.98 0 top
C85  5.33,48.26 270 top
C86  7.62,48.26 270 top
C87  18.29,50.29 0 top
C88  18.29,53.09 0 top
C89  24.13,60.96 270 top
C90  26.42,60.96 270 top
C91  37.34,62.99 0 top
C92  37.34,65.79 0 top
C93  24.13,50.29 270 top
C94  26.42,50.29 270 top
C95  37.34,52.32 0 top
C96  37.34,55.12 0 top
C97  5.33,39.37 270 top
C98  7.62,39.37 270 top
C99  18.54,41.4 0 top
C100  18.54,44.2 0 top
C101  24.13,28.96 270 top
C102  26.42,28.96 270 top
C103  37.34,30.99 0 top
C104  37.34,33.78 0 top
J4  44.45,102.87 270 top
J5  44.45,49.53 270 top
R1  24.13,99.57 0 top
R2  27.18,43.94 0 top
R3  35.31,42.42 0 top
R4  29.97,98.3 270 top
R5  36.83,88.9 0 top
R6  28.19,98.3 90 top
R7  24.13,86.61 0 top
R8  36.83,80.77 0 top
R9  17.53,100.33 270 top
R10  15.75,100.33 90 top
R11  17.53,87.63 270 top
R12  15.75,87.63 90 top
R13  30.23,81.79 270 top
R14  28.45,81.79 90 top
R15  17.53,94.23 270 top
R16  15.75,94.23 90 top
R17  30.23,89.92 270 top
R18  28.45,89.92 90 top
R19  33.53,88.9 0 top
R20  20.83,86.61 0 top
R21  33.53,80.77 0 top
R22  20.83,99.57 0 top
R23  33.27,97.54 0 top
R24  20.83,93.22 0 top
R25  24.38,93.22 0 top
R26  36.58,97.54 0 top
R27  25.15,110.24 270 top
R28  23.37,110.24 90 top
R29  30.48,43.94 0 top
R30  38.61,42.42 0 top
R35  7.87,111.76 270 top
R36  6.1,111.76 90 top
R37  7.62,121.92 270 top
R38  5.84,121.92 90 top
R39  25.4,118.62 270 top
R40  23.62,118.62 90 top
R41  7.62,34.54 270 top
R42  5.84,34.54 90 top
R43  26.42,33.27 270 top
R44  24.64,33.27 90 top
U6  30.23,108.71 270 top
U7  12.95,110.24 270 top
U8  12.95,69.09 270 top
U9  12.7,120.4 270 top
U10  30.48,117.09 270 top
U11  12.7,33.02 270 top
U19  12.7,59.94 270 top
U20  12.7,51.05 270 top
U21  31.5,63.75 270 top
U22  31.5,53.09 270 top
U23  12.7,42.16 270 top
U24  31.5,31.75 270 top
U$1  [MOUNTING_M3]  5.08,147.32 0 top
U$2  [MOUNTING_M3]  5.08,5.08 0 top
U$3  [MOUNTING_M3]  45.72,5.08 0 top
U$4  [MOUNTING_M3]  45.72,147.32 0 top
U$5  [LOGO_HYTECH_LARGE]  0.51,130.05 0 top
U$6  [LOGO_HYTECH_LARGE]  50.29,130.05 0 bottom

### Tracks (layer width: path | path; a pad name or v marks a point on that pad's centre or on a via)
+5V  (via drill 0.36)
  Top 0.254: v11.68,118.62 11.56,118.49 U9.4 7.76,118.49 C38.1 C37.1 | v13.97,120.9 14.1,121.03 U9.7 | v11.68,49.28 11.56,49.15 U20.4 7.76,49.15 C86.1 C85.1 | v13.97,51.56 14.1,51.69 U20.7 | v30.48,61.98 30.35,61.85 U21.4 26.55,61.85 C90.1 C89.1 | v32.77,64.26 32.89,64.39 U21.7 | v11.94,67.31 11.81,67.18 U8.4 8.01,67.18 C34.1 C33.1 | v14.22,69.6 14.35,69.72 U8.7 | v11.68,40.39 10.22,40.39 U23.4 7.76,40.26 C98.1 C97.1 | v13.97,42.67 14.1,42.8 U23.7 | v11.68,58.17 11.56,58.04 U19.4 7.76,58.04 C82.1 C81.1 | v13.97,60.45 14.1,60.58 U19.7 | v30.48,51.31 30.35,51.18 U22.4 26.55,51.18 C94.1 C93.1 | v32.77,53.59 32.89,53.72 U22.7 | v29.21,106.93 27.75,106.93 U6.4 27.48,106.67 C26.1 C25.1 | v31.5,109.22 31.62,109.35 U6.7 | v11.94,108.46 11.81,108.33 U7.4 8.01,108.33 C30.1 C29.1 | v14.22,110.74 14.35,110.87 U7.7 | v29.46,115.32 29.34,115.19 U10.4 27.74,115.05 C42.1 C41.1 | v31.75,117.6 31.88,117.73 U10.7 | v11.68,31.24 10.22,31.24 U11.4 7.76,31.11 C46.1 C45.1 | v13.97,33.53 14.1,33.66 U11.7 | v30.48,29.97 29.02,29.97 U24.4 26.55,29.84 C102.1 C101.1 | v32.77,32.26 32.89,32.38 U24.7
  pour Bottom (rank 2): -0.25,152.65 -0.25,-0.25 51.05,-0.25 51.05,152.65
ACCEL_1
  Top 0.254: U8.5 25.02,67.18 27.94,70.1 37.88,70.1 J5.5
ACCEL_1_EXT
  Top 0.254: J5.3 35.81,74.17 9.91,74.17 7.87,72.14 7.87,70.61 8.76,69.72 U8.2
ACCEL_2
  Top 0.254: U21.5 42.13,61.85 J5.9
ACCEL_2_EXT
  Top 0.254: J5.7 37.4,68.58 28.45,68.58 26.42,66.55 26.42,65.28 27.43,64.26 28.77,64.26 U21.2
BRAKE_1
  Top 0.254: U19.5 41.94,58.04 J5.13
BRAKE_1_EXT
  Top 0.254: U19.2 9.97,60.45 8.64,60.45 7.87,61.21 7.87,62.48 9.65,64.26 19.56,64.26 20.83,62.99 20.83,61.21 22.75,59.29 42.69,59.29 J5.11
BRAKE_2
  Top 0.254: U22.5 42.1,51.18 J5.17
BRAKE_2_EXT
  Top 0.254: U22.2 27.56,53.72 26.67,54.61 26.67,56.13 27.43,56.9 41.08,56.9 J5.15
BRAKE_PRESSURE_F  (via drill 0.36)
  Top 0.254: C9.1 31.23,43.84 R29.2 31.58,44.2 v32.51,44.2
  Bottom 0.254: v32.51,44.2 42.37,44.2 42.99,43.58 44.4,43.58 J5.28
BRAKE_PRESSURE_F_EXT
  Top 0.254: R2.1 27.85,45.47 40.64,45.47 43.45,42.66 J5.27
BRAKE_PRESSURE_R  (via drill 0.36)
  Top 0.254: C10.1 39.46,40.74 R30.2 v40.63,42.42 v40.64,42.41
  Bottom 0.254: v40.64,42.41 42.15,42.41 43.04,41.52 44.45,41.52 J5.30
BRAKE_PRESSURE_R_EXT
  Top 0.254: J5.29 43.45,40.78 40.55,43.69 35.56,43.69 34.46,42.58 R3.1
CURRENT
  Top 0.254: U11.5 20.95,31.11 22.1,32.26 22.1,35.81 23.82,37.53 44.6,37.53 45.45,36.68 J5.34
CURRENT_EXT
  Top 0.254: R41.1 7.62,36.16 10.07,38.61 39.93,38.61 40.87,39.55 44,39.55 45.02,38.53 J5.32
CURRENT_EXT_5V
  Top 0.254: R42.1 R41.2 10.06,33.69 U11.2
GND  (via drill 0.36)
  Top 0.254: C87.2 19.04,49.03 v19.05,49.02 | v19.05,46.23 19.29,45.99 C100.2 | C95.2 v39.37,52.32 | C91.2 v39.62,62.99 | C35.2 v20.83,68.33 | v20.32,60.45 19.29,61.48 C84.2 | C83.2 v20.57,59.18 | v22.73,60.32 24.02,60.32 C89.2 | C99.2 v20.57,41.4 | v25.15,41.66 26.17,41.66 C2.2 | C48.2 v20.57,35.05 | v23.11,35.05 23.71,35.05 R44.2
  Bottom 0.254: v19.05,49.02 v19.05,46.23 | J5.18 44.8,52.53 43.84,53.48 40.53,53.48 v39.37,52.32 | v39.62,62.99 42.56,62.99 43.05,63.48 44.5,63.48 J5.8 | v20.83,68.33 20.83,60.96 v20.32,60.45 | v20.57,59.18 21.59,59.18 v22.73,60.32 | v20.57,41.4 24.89,41.4 v25.15,41.66 | v20.57,35.05 v23.11,35.05
  pour Top: -0.25,152.65 -0.25,-0.25 51.05,-0.25 51.05,152.65
  pour Bottom: 47.24,121.16 35.56,121.16 35.56,24.64 47.24,24.64
LOAD_FL
  Top 0.254: U9.5 20.45,118.49 21.08,119.13 21.08,121.41 22.86,123.19 38.13,123.19 J4.5
LOAD_FL_EXT
  Top 0.254: R37.1 9.82,124.97 38.35,124.97 J4.3
LOAD_FL_EXT_5V
  Top 0.254: U9.2 10.06,121.07 R37.2 R38.1
LOAD_FR
  Top 0.254: J4.9 42.13,115.19 U10.5
LOAD_FR_EXT
  Top 0.254: J4.7 42.94,115.87 38.16,120.65 26.58,120.65 R39.1
LOAD_FR_EXT_5V
  Top 0.254: U10.2 27.84,117.77 R39.2 R40.1
LOAD_RL
  Top 0.254: U6.5 32.96,106.68 40.39,106.68 43.58,109.87 J4.13
LOAD_RL_EXT
  Top 0.254: R27.1 25.15,111.76 25.65,112.27 43.05,112.27 J4.11
LOAD_RL_EXT_5V
  Top 0.254: R28.1 R27.2 27.58,109.39 U6.2
LOAD_RR
  Top 0.254: U7.5 15.56,106.87 19.05,103.38 40.89,103.38 43.39,105.87 J4.17
LOAD_RR_EXT
  Top 0.254: R35.1 7.87,113.54 9.4,115.06 19.56,115.06 20.83,113.79 20.83,105.16 21.84,104.14 39.62,104.14 43.43,107.95 43.37,107.95 J4.15
LOAD_RR_EXT_5V
  Top 0.254: R36.1 R35.2 10.31,110.91 U7.2
N$1
  Top 0.254: U6.8 35.19,110.62 C28.1
N$2
  Top 0.254: C27.1 35.19,108.08 U6.6 31.62,108.08 29.08,110.62 U6.1
N$4
  Top 0.254: R1.1 R22.2 21.58,99.47 C52.1
N$5
  Top 0.254: R5.1 R19.2 34.38,87.22 C49.1
N$6
  Top 0.254: C50.1 21.68,84.94 R20.2 R7.1
N$7
  Top 0.254: R8.1 R21.2 34.38,79.09 C51.1
N$8
  Top 0.254: R25.1 R24.2 21.68,91.54 C54.1
N$9
  Top 0.254: R26.1 R23.2 34.12,95.86 C53.1
N$10
  Top 0.254: R29.1 R2.2 28.03,42.01 C2.1
N$11
  Top 0.254: C3.1 36.06,42.32 R3.2 R30.1
N$13
  Top 0.254: U7.8 15.68,112.27 C32.1
N$14
  Top 0.254: U7.1 11.81,112.14 14.35,109.6 U7.6 17.92,109.6 C31.1
N$15
  Top 0.254: U8.8 17.92,70.99 C36.1
N$16
  Top 0.254: C35.1 17.92,68.45 U8.6 14.35,68.45 11.81,70.99 U8.1
N$17
  Top 0.254: C40.1 17.92,122.3 U9.8
N$18
  Top 0.254: C39.1 15.43,119.63 U9.6 15.18,119.63 14.22,119.63 11.56,122.3 U9.1
N$19
  Top 0.254: U10.8 35.45,119 C44.1
N$20
  Top 0.254: C43.1 35.45,116.46 U10.6 31.88,116.46 29.34,119 U10.1
N$21
  Top 0.254: U11.8 17.66,34.92 C48.1
N$22
  Top 0.254: C47.1 17.66,32.38 U11.6 14.1,32.38 11.56,34.92 U11.1
N$23
  Top 0.254: U19.8 15.43,61.98 C84.1
N$24
  Top 0.254: C83.1 17.66,59.31 U19.6 14.1,59.31 11.56,61.85 U19.1
N$39
  Top 0.254: U20.8 15.43,53.09 C88.1
N$40
  Top 0.254: C87.1 17.41,50.42 U20.6 14.1,50.42 11.56,52.96 U20.1
N$41
  Top 0.254: U21.8 36.46,65.66 C92.1
N$42
  Top 0.254: C91.1 36.46,63.12 U21.6 32.89,63.12 30.35,65.66 U21.1
N$43
  Top 0.254: U22.8 36.46,54.99 C96.1
N$44
  Top 0.254: C95.1 36.46,52.45 U22.6 32.89,52.45 30.35,54.99 U22.1
N$45
  Top 0.254: U23.8 15.43,44.2 C100.1
N$46
  Top 0.254: U23.1 11.56,44.07 14.1,41.53 U23.6 17.66,41.53 C99.1
N$47
  Top 0.254: U24.8 36.46,33.66 C104.1
N$48
  Top 0.254: C103.1 36.46,31.11 U24.6 32.89,31.11 30.35,33.66 U24.1
REFERENCE
  Top 0.254: U24.5 41.4,29.84 43.05,31.5 44.7,31.5 45.45,32.24 J5.38
REFERENCE_EXT
  Top 0.254: R43.1 28.36,36.07 39.55,36.07 40.06,35.56 44.45,35.56 45.45,34.56 J5.36
REFERENCE_EXT_5V
  Top 0.254: R44.1 R43.2 28.85,32.42 U24.2
SPN_POT_1
  Top 0.254: C1.1 24.98,97.89 R1.2 26.25,100.84 42.42,100.84 J4.21
SPN_POT_1_EXT
  Top 0.254: R9.1 18.96,102.62 42.2,102.62 J4.19
SPN_POT_1_EXT_5V
  Top 0.254: R10.1 R9.2 19.89,99.48 R22.1
SPN_POT_2
  Top 0.254: C8.1 37.43,95.86 R26.2 43.12,97.54 J4.25
SPN_POT_2_EXT
  Top 0.254: J4.23 43.42,99.84 43.18,100.08 30.9,100.08 R4.1
SPN_POT_2_EXT_5V
  Top 0.254: R6.1 R4.2 30.06,97.54 R23.1
SPN_POT_3
  Top 0.254: C7.1 25.23,91.54 R25.2 25.49,92.96 42.54,92.96 J4.29
SPN_POT_3_EXT
  Top 0.254: J4.27 41.31,93.73 30.48,93.73 28.45,95.76 18.8,95.76 18.12,95.08 R15.1
SPN_POT_3_EXT_5V
  Top 0.254: R24.1 19.81,93.38 R15.2 R16.1
SPN_POT_4
  Top 0.254: J4.33 43.4,89.92 38.7,89.92 R5.2 37.58,88.8 C4.1
SPN_POT_4_EXT
  Top 0.254: R17.1 31.66,92.2 43.12,92.2 J4.31
SPN_POT_4_EXT_5V
  Top 0.254: R18.1 R17.2 32.51,89.07 R19.1
SPN_POT_5
  Top 0.254: C5.1 24.98,84.94 R7.2 26.92,86.61 29.21,84.33 41.91,84.33 J4.37
SPN_POT_5_EXT
  Top 0.254: J4.35 40.67,85.09 30.23,85.09 26.42,88.9 17.95,88.9 R11.1
SPN_POT_5_EXT_5V
  Top 0.254: R12.1 R11.2 19.81,86.78 R20.1
SPN_POT_6
  Top 0.254: C6.1 37.68,79.09 R8.2 39.88,78.57 39.88,71.88 43.23,68.53 J5.1
SPN_POT_6_EXT
  Top 0.254: J4.39 43.15,83.57 31.15,83.57 R13.1
SPN_POT_6_EXT_5V
  Top 0.254: R14.1 R13.2 32.51,80.94 R21.1
STEERING_1
  Top 0.254: J5.21 42.67,47.75 16.7,47.75 U20.5
STEERING_1_EXT
  Top 0.254: U20.2 8.76,51.69 7.87,52.58 7.87,53.85 9.65,55.63 19.05,55.63 21.08,53.59 21.08,50.55 23.11,48.51 41.43,48.51 J5.19
STEERING_2
  Top 0.254: U23.5 22.48,40.26 24.38,42.16 24.38,44.96 25.65,46.23 41.75,46.23 J5.25
STEERING_2_EXT
  Top 0.254: U23.2 9.97,42.67 8.64,42.67 7.87,43.43 7.87,45.21 9.65,46.99 42.99,46.99 J5.23

### Text on the board
tPlace: HyTech Racing 2023 / Filter Board rev1 / Designed by Eric Galluzzi | HyTech Racing 2023 / Filter Board rev1 / Designed by Eric Galluzzi
bPlace: HyTech Racing 2023 / Filter Board rev1 / Designed by Eric Galluzzi